# EAGLE schematic Curio_adrcontrol (EAGLE 7.2.0)
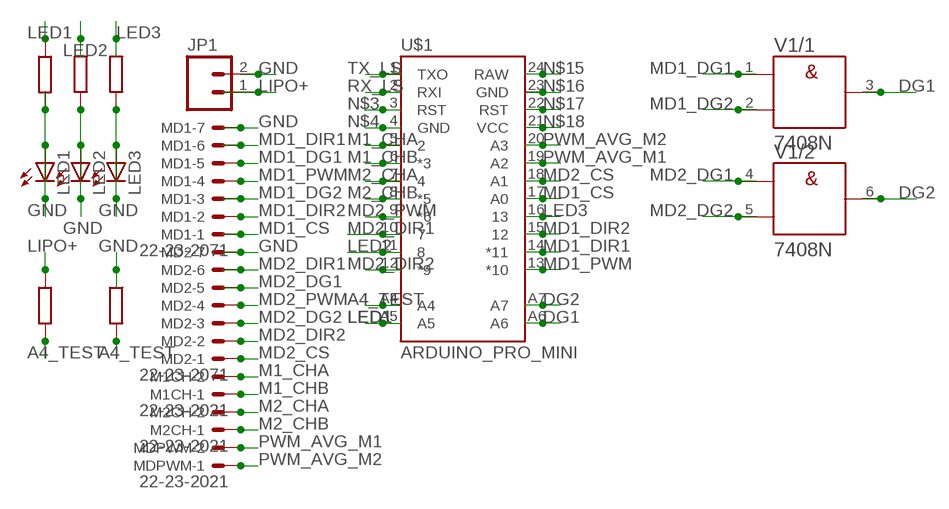
[diagram p0: schematic, sheet 1]

## Parts
JP1  M025MM  [SCREWTERMINAL-5MM-2]
LED1  LED  [SMARTLED-TTW]
LED2  LED  [SMARTLED-TTW]
LED3  LED  [SMARTLED-TTW]
M1CH  22-23-2021  [22-23-2021]
M2CH  22-23-2021  [22-23-2021]
MD1  22-23-2071  [22-23-2071]
MD2  22-23-2071  [22-23-2071]
MDPWM  22-23-2021  [22-23-2021]
U$1  ARDUINO_PRO_MINI  [ARDUINO_PRO_MINI]
V1  7408N  [DIL14]

## Nets
A4_TEST: U$1.A4
DG1: U$1.A6 V1.3(/1:Y)
DG2: U$1.A7 V1.6(/2:Y)
GND: JP1.2 LED1.C@1(C) LED2.C@1(C) LED3.C@1(C) MD1.7 MD2.7
LED1: U$1.A5
LED2: U$1.11
LED3: U$1.16
LIPO+: JP1.1
M1_CHA: M1CH.2 U$1.5
M1_CHB: M1CH.1 U$1.6(*3)
M2_CHA: M2CH.2 U$1.7
M2_CHB: M2CH.1 U$1.8(*5)
MD1_CS: MD1.1 U$1.17(A0)
MD1_DG1: MD1.5 V1.1(/1:A)
MD1_DG2: MD1.3 V1.2(/1:B)
MD1_DIR1: MD1.6 U$1.14(*11)
MD1_DIR2: MD1.2 U$1.15
MD1_PWM: MD1.4 U$1.13(*10)
MD2_CS: MD2.1 U$1.18(A1)
MD2_DG1: MD2.5 V1.4(/2:A)
MD2_DG2: MD2.3 V1.5(/2:B)
MD2_DIR1: MD2.6 U$1.10
MD2_DIR2: MD2.2 U$1.12(*9)
MD2_PWM: MD2.4 U$1.9(*6)
N$1: LED1.A@1(A)
N$3: U$1.3(RST)
N$4: U$1.4(GND)
N$5: LED2.A@1(A)
N$6: LED3.A@1(A)
N$15: U$1.24(RAW)
N$16: U$1.23(GND)
N$17: U$1.22(RST)
N$18: U$1.21(VCC)
PWM_AVG_M1: MDPWM.2 U$1.19(A2)
PWM_AVG_M2: MDPWM.1 U$1.20(A3)
RX_LS: U$1.2(RXI)
TX_LS: U$1.1(TXO)
Unconnected: V1.8(/3:Y) V1.9(/3:A) V1.10(/3:B) V1.11(/4:Y) V1.12(/4:A) V1.13(/4:B)

## Power pins joined to a net without a drawn wire
+UB: V1.14(/+UB:+UB)
-UB: V1.7(/-UB:-UB)

## Library data of the parts
JP1 = SparkFun-Connectors:M02: Standard 2-pin 0.1" header. Use with - straight break away headers ( PRT-00116) - right angle break away headers (PRT-00553) - swiss pins (PRT-00743) - machine pins (PRT-00117) - female headers (PRT-00115) Molex polarized connector foot print use with: PRT-08233 with associated crimp pins and housings. 2.54_SCREWTERM for use with PRT-10571. 3.5mm Screw Terminal footprints for PRT-08084 5mm Screw Terminal footprints for use with PRT-08432; STOREFRONT_ID: PRT-08432
LED1-LED3 = led:LED: LED OSRAM: - CHIPLED LG R971, LG N971, LY N971, LG Q971, LY Q971, LO R971, LY R971 LH N974, LH R974 LS Q976, LO Q976, LY Q976 LO Q996 - Hyper CHIPLED LW Q18S LB Q993, LB Q99A, LB R99A - SideLED LS A670, LO A670, LY A670, LG A670, LP A670 LB A673, LV A673, LT A673, LW A673 LH A674 LY A675 LS A676, LA A676, LO A676, LY A676, LW A676 LS A679, LY A679, LG A679 - Hyper Micro SIDELED® LS Y876, LA Y876, LO Y876, LY Y876 LT Y87S - SmartLED LW L88C, LW L88S LB L89C, LB L89S, LG L890 LS L89K, LO L89K, LY L89K LS L896, LA L896, LO L896, LY L896 - TOPLED LS T670, LO T670, LY T670, LG T670, LP T670 LSG T670, LSP T670, LSY T670, LOP T670, LYG T670 LG T671, LOG T671, LSG T671 LB T673, LV T673, LT T673, LW T673 LH T674 LS T676, LA T676, LO T676, LY T676, LB T676, LH T676, LSB T676, LW T676 LB T67C, LV T67C, LT T67C, LS T67K, LO T67K, LY T67K, LW E67C LS E67B, LA E67B, LO E67B, LY E67B, LB E67C, LV E67C, LT E67C LW T67C LS T679, LY T679, LG T679 LS T770, LO T770, LY T770, LG T770, LP T770 LB T773, LV T773, LT T773, LW T773 LH T774 LS E675, LA E675, LY E675, LS T675 LS T776, LA T776, LO T776, LY T776, LB T776 LHGB T686 LT T68C, LB T68C - Hyper Mini TOPLED® LB M676 - Mini TOPLED Santana® LG M470 LS M47K, LO M47K, LY M47K Source: http://www.osram.convergy.de LUXEON: - LUMILED® LXK2-PW12-R00, LXK2-PW12-S00, LXK2-PW14-U00, LXK2-PW14-V00 LXK2-PM12-R00, LXK2-PM12-S00, LXK2-PM14-U00 LXK2-PE12-Q00, LXK2-PE12-R00, LXK2-PE12-S00, LXK2-PE14-T00, LXK2-PE14-U00 LXK2-PB12-K00, LXK2-PB12-L00, LXK2-PB12-M00, LXK2-PB14-N00, LXK2-PB14-P00, LXK2-PB14-Q00 LXK2-PR12-L00, LXK2-PR12-M00, LXK2-PR14-Q00, LXK2-PR14-R00 LXK2-PD12-Q00, LXK2-PD12-R00, LXK2-PD12-S00 LXK2-PH12-R00, LXK2-PH12-S00 LXK2-PL12-P00, LXK2-PL12-Q00, LXK2-PL12-R00 Source: www.luxeon.com KINGBRIGHT: KA-3528ASYC Source: www.kingbright.com
M1CH M2CH MDPWM = con-molex:22-23-2021: .100" (2.54mm) Center Header - 2 Pin; MF: MOLEX; MPN: 22-23-2021; OC_FARNELL: 1462926; OC_NEWARK: 25C3832
MD1 MD2 = con-molex:22-23-2071: .100" (2.54mm) Center Header - 7 Pin; MF: MOLEX; MPN: 22-23-2071; OC_FARNELL: 1654534; OC_NEWARK: 56H0445
U$1 = SparkFun-Boards:ARDUINO_PRO_MINI
V1 = 74ttl-din:74*08: Quad 2-input AND gate